# Altium project motordriver-v3.1.PrjPCB
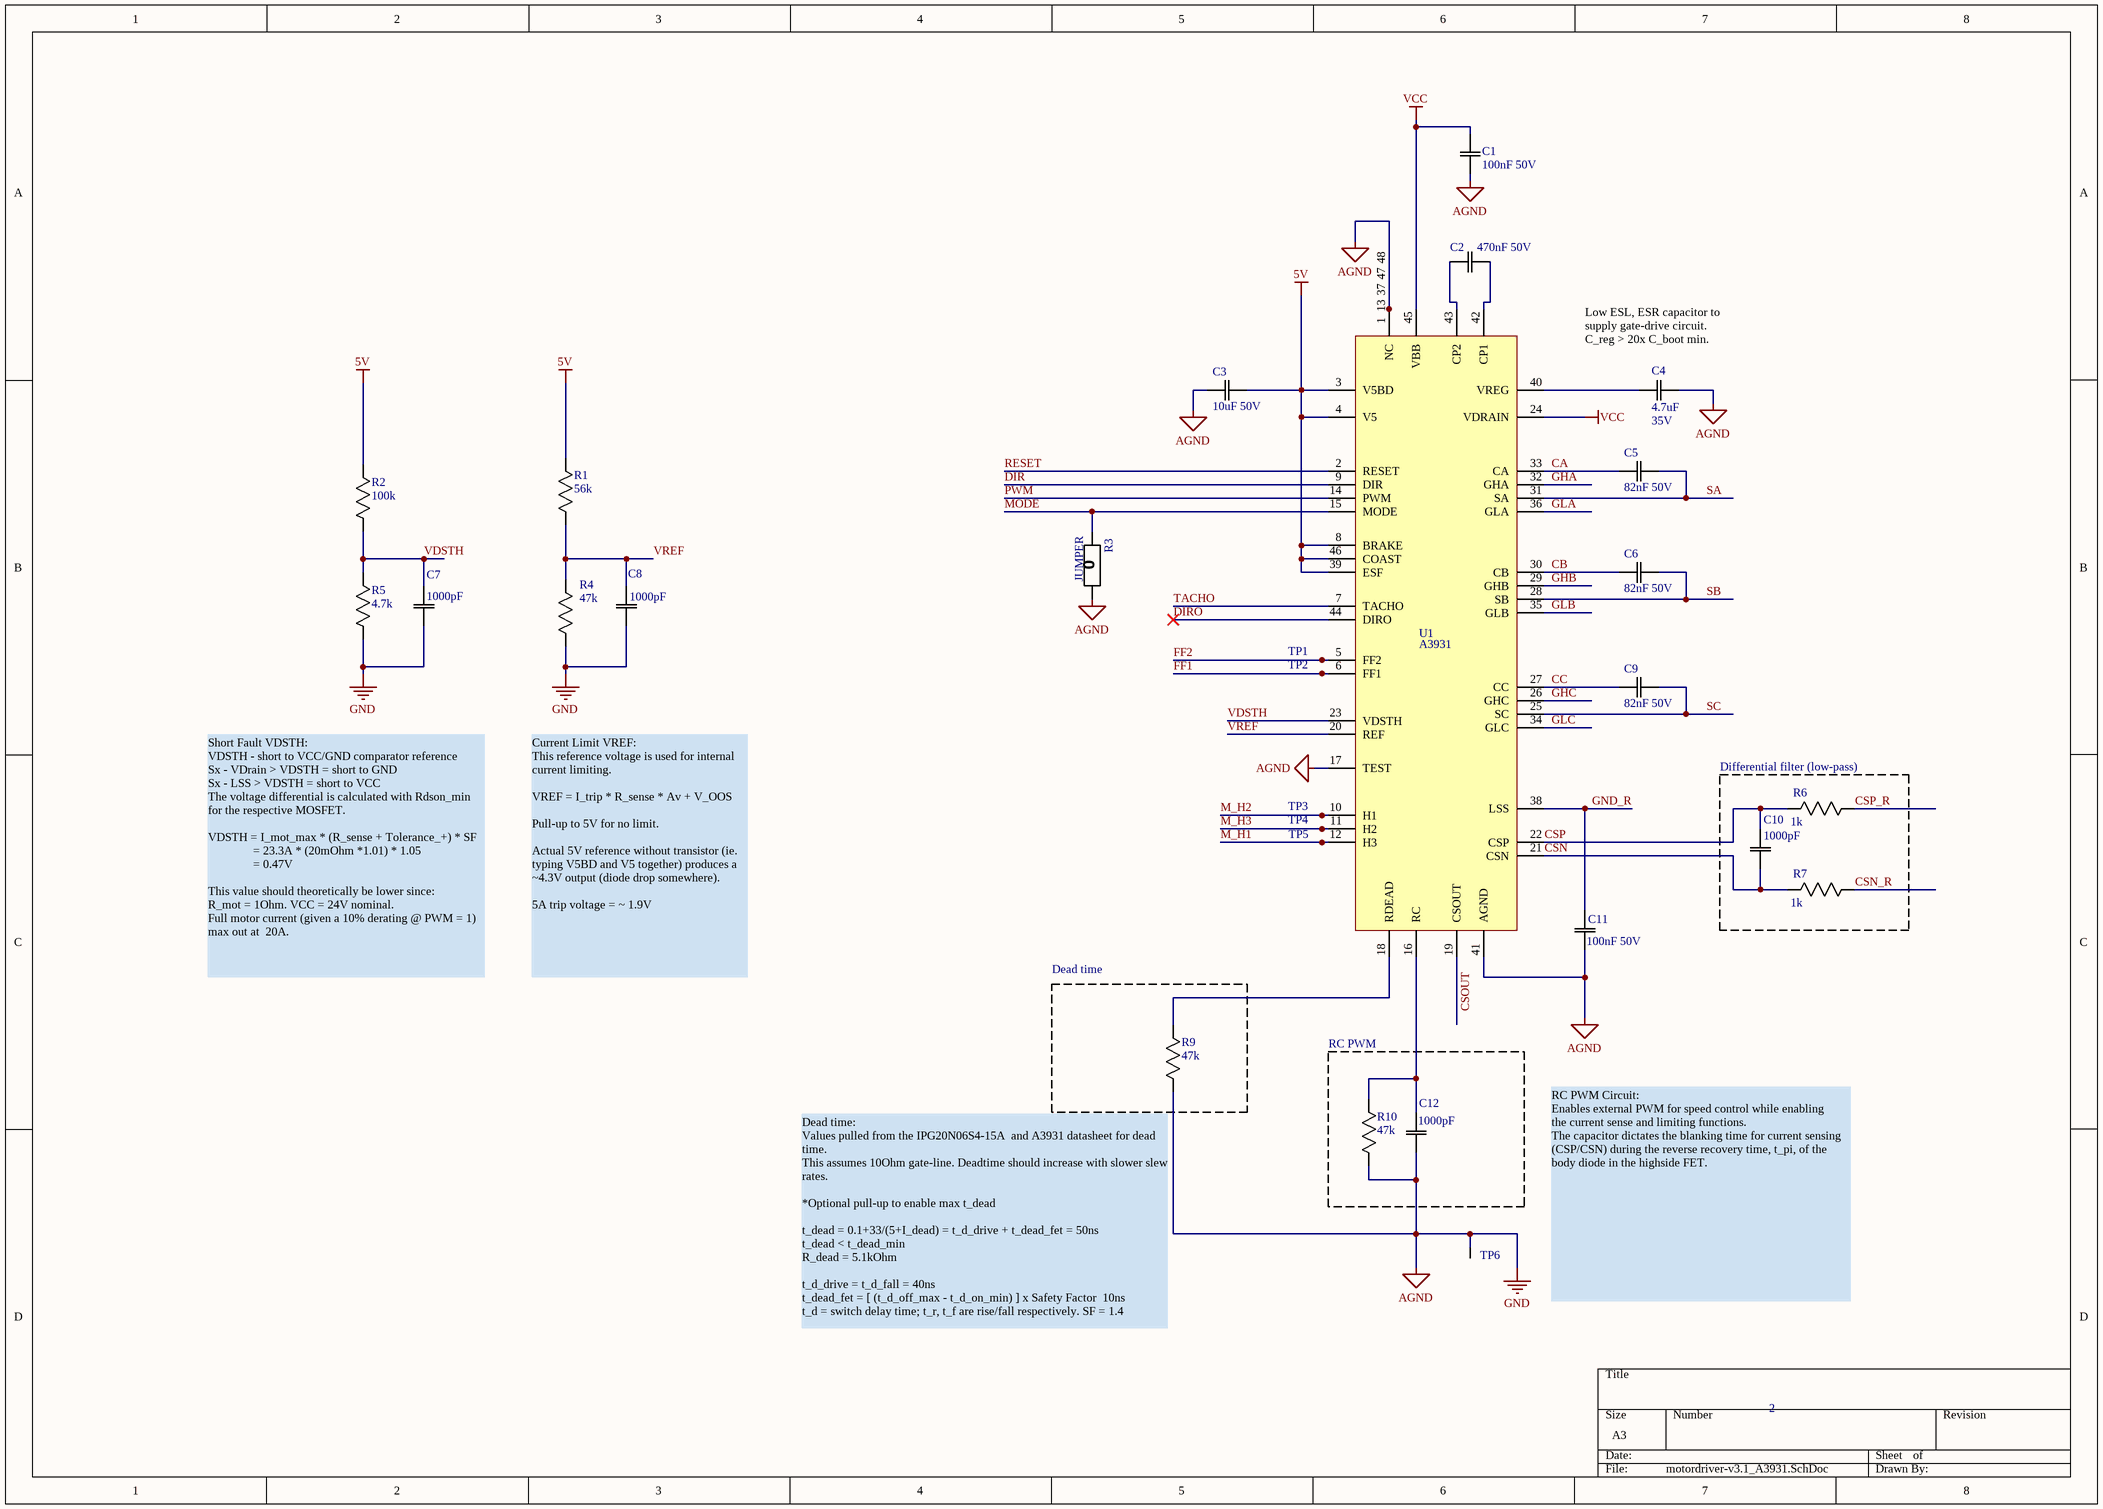
[diagram p0: motordriver-v3.1_A3931.SchDoc]
3 sheets, 53 parts. Net scope: global (net labels, ports and power ports of the same name join across sheets).
Board files: motordriver-v3.1-panelization.PcbDoc, motordriver-v3.1_PCIE.PcbDoc
Sheets:
  motordriver-v3.1_A3931.SchDoc
  motordriver-v3.1_power-stage.SchDoc
  motordriver-v3.1_IO.SchDoc

## Sheet motordriver-v3.1_A3931.SchDoc
size A3

### Parts
C1  100nF 50V  [0603]
C2  470nF 50V  [0603]
C3  10uF 50V  [0805]
C4  Rating: 35V  [0603]  (hidden comment: 4.7uF)
C5  82nF 50V  [0603]
C6  82nF 50V  [0603]
C7  1000pF  [0603]
C8  1000pF  [0603]
C9  82nF 50V  [0603]
C10  1000pF  [0603]
C11  100nF 50V  [0603]
C12  1000pF  [0603]
R1  56k  [0603]
R2  100k  [0603]
R3  JUMPER  [0603]
R4  47k  [0603]
R5  4.7k  [0603]
R6  1k  [0603]
R7  1k  [0603]
R9  47k  [0603]
R10  47k  [0603]
TP1  Test Point (Via)  [TP]  (value not drawn)
TP2  Test Point (Via)  [TP]  (value not drawn)
TP3  Test Point (Via)  [TP]  (value not drawn)
TP4  Test Point (Via)  [TP]  (value not drawn)
TP5  Test Point (Via)  [TP]  (value not drawn)
TP6  Test Point (Via)  [TP]  (value not drawn)
U1  A3931  [48-LQFP-EP (7x7)]

### Blocks framed on the sheet
Differential filter (low-pass): C10 R6 R7
Dead time: R9
RC PWM: C12 R10

### Nets
5V: C3.2(C2) R1.1(R1) R2.1(R1) U1.3(V5BD) U1.4(V5) U1.8(BRAKE) U1.39(ESF) U1.46(COAST)
AGND: C1.1(C1) C3.1(C1) C4.2(C2) C7.1(C1) C8.1(C1) C11.1(C1) C12.1(C1) R3.1(R1) R4.1(R1) R5.2(R2) R9.2(R2) R10.2(R2) TP6.1 U1.1(NC) U1.13 U1.17(TEST) U1.37(NC) U1.41(AGND) U1.47(NC) U1.48(NC)  [also labelled GND]
VCC: C1.2(C2) U1.24(VDRAIN) U1.45(VBB)
CA: C5.1(C1) U1.33(CA)
CB: C6.1(C1) U1.30(CB)
CC: C9.1(C1) U1.27(CC)
CSN: C10.1(C1) R7.2(R2) U1.21(CSN)
CSN_R: R7.1(R1)
CSOUT: U1.19(CSOUT)
CSP: C10.2(C2) R6.2(R2) U1.22(CSP)
CSP_R: R6.1(R1)
DIR: U1.9(DIR)
DIRO: U1.44(DIRO)
FF1: TP2.1 U1.6(FF1)
FF2: TP1.1 U1.5(FF2)
GHA: U1.32(GHA)
GHB: U1.29(GHB)
GHC: U1.26(GHC)
GLA: U1.36(GLA)
GLB: U1.35(GLB)
GLC: U1.34(GLC)
GND_R: C11.2(C2) U1.38(LSS)
M_H1: TP5.1 U1.12(H3)
M_H2: TP3.1 U1.10(H1)
M_H3: TP4.1 U1.11(H2)
MODE: R3.2(R2) U1.15(MODE)
PWM: U1.14(PWM)
RESET: U1.2(RESET)
SA: C5.2(C2) U1.31(SA)
SB: C6.2(C2) U1.28(SB)
SC: C9.2(C2) U1.25(SC)
TACHO: U1.7(TACHO)
VDSTH: C7.2(C2) R2.2(R2) R5.1(R1) U1.23(VDSTH)
VREF: C8.2(C2) R1.2(R2) R4.2(R2) U1.20(REF)
NetC2_1: C2.1(C1) U1.43(CP2)
NetC2_2: C2.2(C2) U1.42(CP1)
NetC4_1: C4.1(C1) U1.40(VREG)
NetC12_2: C12.2(C2) R10.1(R1) U1.16(RC)
NetR9_1: R9.1(R1) U1.18(RDEAD)

### Notes on the sheet
- (near C4) Low ESL, ESR capacitor to supply gate-drive circuit.
  C_reg > 20x C_boot min.
- Short Fault VDSTH:
  VDSTH - short to VCC/GND comparator reference
  Sx - VDrain > VDSTH = short to GND
  Sx - LSS > VDSTH = short to VCC
  The voltage differential is calculated with Rdson_min for the respective MOSFET.
  VDSTH = I_mot_max * (R_sense + Tolerance_+) * SF
  = 23.3A * (20mOhm *1.01) * 1.05
  = 0.47V
  This value should theoretically be lower since:
  R_mot = 1Ohm. VCC = 24V nominal.
  Full motor current (given a 10% derating @ PWM = 1) max out at  20A.
- Current Limit VREF:
  This reference voltage is used for internal current limiting.
  VREF = I_trip * R_sense * Av + V_OOS
  Pull-up to 5V for no limit.
  Actual 5V reference without transistor (ie. typing V5BD and V5 together) produces a ~4.3V output (diode drop somewhere).
  5A trip voltage = ~ 1.9V
- (near R9) Dead time:
  Values pulled from the IPG20N06S4-15A  and A3931 datasheet for dead time.
  This assumes 10Ohm gate-line. Deadtime should increase with slower slew rates.
  *Optional pull-up to enable max t_dead
  t_dead = 0.1+33/(5+I_dead) = t_d_drive + t_dead_fet = 50ns
  t_dead < t_dead_min
  R_dead = 5.1kOhm
  t_d_drive = t_d_fall = 40ns
  t_dead_fet = [ (t_d_off_max - t_d_on_min) ] x Safety Factor  10ns
  t_d = switch delay time; t_r, t_f are rise/fall respectively. SF = 1.4
- RC PWM Circuit:
  Enables external PWM for speed control while enabling
  the current sense and limiting functions.
  The capacitor dictates the blanking time for current sensing
  (CSP/CSN) during the reverse recovery time, t_pi, of the
  body diode in the highside FET.
- 2

### Library data of the parts
C1 C11 = CAP 100nF 50V: CAP CER 0.1UF 50V X7R 0805; Tolerance: 10%; Package: 0805; Value: 100nF; Rating: 50V
C2 = CAP 470nF 50V: CAP CER 0.1UF 50V X7R 0805; Tolerance: 10%; Package: 0805; Value: 470nF; Rating: 50V
C3 = CAP 10uF 50V: CAP CER 10UF 50V X7R; Tolerance: 10%; Package: 1210; Value: 10uF; Rating: 50V; ComponentLink1Description: digikey; ComponentLink1URL: https://www.digikey.ca/en/products/detail/kemet/C1210C106M5RACTU/4918883
C4 = CAP 4.7uF 35V: CAP CER 4.7UF 35V X7R 0603/0805; Tolerance: 10%; Package: 0603/0805; Temperature Coefficient: X7R; Operating Temperature: -55°C ~ 125°C; Value: 4.7uF
C5 C6 C9 = CAP 82nF 50V: CAP CER 0.082UF 50V X7R 0805; Tolerance: 5%; Package: 0805; Value: 82nF; Rating: 50V; Alt. Value: 82nF
C7 C8 C10 C12 = CAP 1000pF 50V: CAP CER 1000PF 50V X7R 0603/0805; Tolerance: 10%; Package: 0603/0805; Value: 1000pF; Rating: 50V; Temperature Coefficient: X7R; Operating Temperature: -55°C ~ 125°C
R1 R2 = RES 100k 1/8W - 1%: RES SMD 100K OHM 1% 1/8W 0805; Power (Watts): 0.125W; Package: 0805; Value: 100k; Tolerance: 1%
R3 = RES 0 JUMPER: RES SMD 0 OHM JUMPER GENERIC 0805; Value: 0; Package: 0805
R4 R10 = RES 47k 1/8W - 1%: RES SMD 47K OHM 1% 1/8W 0805; Power (Watts): 0.125W; Package: 0805; Value: 47k; Tolerance: 1%
R5 = RES 4.7k 1/8W - 1%: RES SMD 4.7k OHM 1% 1/8W 0805; Power (Watts): 0.125W; Package: 0805; Value: 4.7k; Tolerance: 1%
R6 R7 = RES 1k 1/8W: RES SMD 1K OHM 5% 1/8W 0805; Power (Watts): 0.125W; Package: 0805; Value: 1k; Tolerance: 5%
R9 = RES 5.1k 1/8W - 1%: RES SMD 5.1K OHM 1% 1/8W 0805; Power (Watts): 0.125W; Package: 0805; Value: 5.1k; Tolerance: 1%
U1 = A3931_A1: IC MOTOR DRIVER 5.5V-50V 48LQFP - Alternative Symbol; Digikey: 620-1290-1-ND; Digikey Link: https://www.digikey.ca/product-detail/en/allegro-microsystems/A3931KJPTR-T/620-1290-1-ND/2000021; Supplier 1: Digi-Key; Supplier Part Number 1: 620-1290-1-ND

## Sheet motordriver-v3.1_power-stage.SchDoc
size A
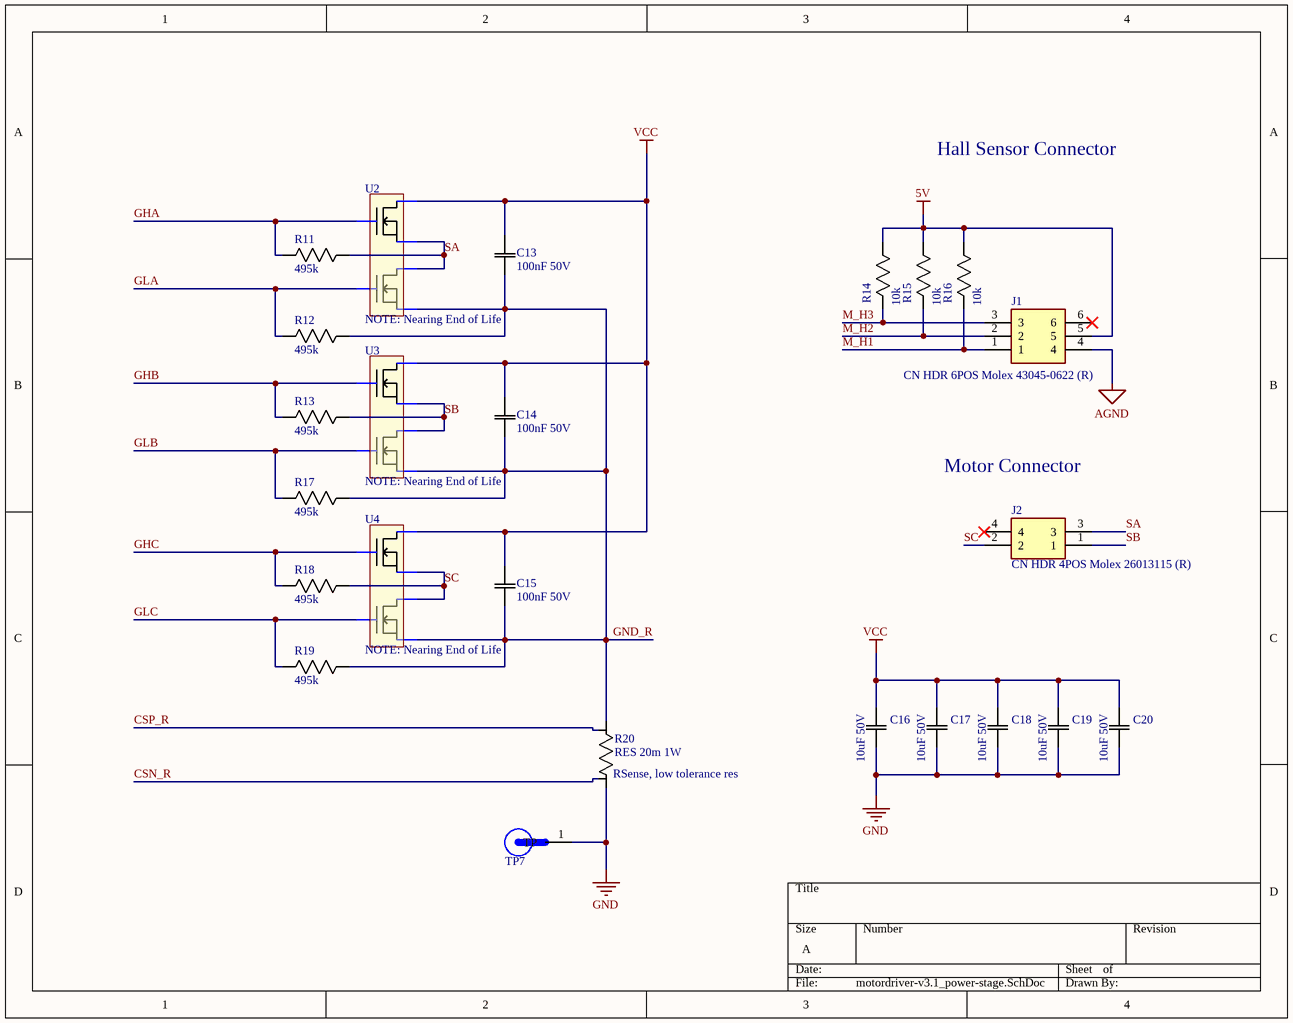
[diagram p1: motordriver-v3.1_power-stage.SchDoc]

### Parts
C13  100nF 50V  [0603]
C14  100nF 50V  [0603]
C15  100nF 50V  [0603]
C16  10uF 50V  [0805]
C17  10uF 50V  [0805]
C18  10uF 50V  [0805]
C19  10uF 50V  [0805]
C20  10uF 50V  [0805]
J1  CN HDR 6POS Molex 43045-0622 (R)  [430450622]
J2  CN HDR 4POS Molex 26013115 (R)  [26013115]
R11  495k  [0603]
R12  495k  [0603]
R13  495k  [0603]
R14  10k  [0603]
R15  10k  [0603]
R16  10k  [0603]
R17  495k  [0603]
R18  495k  [0603]
R19  495k  [0603]
R20  RES 20m 1W  [1206 - Sense]
TP7  Test Point - 5019  [TP380X203]  (value not drawn)
U2  NOTE: Nearing End of Life  [PG-TDSON-8-10]
U3  NOTE: Nearing End of Life  [PG-TDSON-8-10]
U4  NOTE: Nearing End of Life  [PG-TDSON-8-10]

### Nets
5V: J1.5 R14.1(R1) R15.1(R1) R16.1(R1)
AGND: C16.2(C2) C17.2(C2) C18.2(C2) C19.2(C2) C20.2(C2) J1.4 R20.2(R2) TP7.1(TP)  [also labelled GND]
VCC: C13.2(C2) C14.2(C2) C15.2(C2) C16.1(C1) C17.1(C1) C18.1(C1) C19.1(C1) C20.1(C1) U2.8(D1) U3.8(D1) U4.8(D1)
CSN_R: R20.4
CSP_R: R20.3
GHA: R11.2(R2) U2.2(G1)
GHB: R13.2(R2) U3.2(G1)
GHC: R18.2(R2) U4.2(G1)
GLA: R12.2(R2) U2.4(G2)
GLB: R17.2(R2) U3.4(G2)
GLC: R19.2(R2) U4.4(G2)
GND_R: C13.1(C1) C14.1(C1) C15.1(C1) R12.1(R1) R17.1(R1) R19.1(R1) R20.1(R1) U2.3(S2) U3.3(S2) U4.3(S2)
M_H1: J1.1 R16.2(R2)
M_H2: J1.2 R15.2(R2)
M_H3: J1.3 R14.2(R2)
SA: J2.3 R11.1(R1) U2.1(S1) U2.6(D2)
SB: J2.1 R13.1(R1) U3.1(S1) U3.6(D2)
SC: J2.2 R18.1(R1) U4.1(S1) U4.6(D2)

Not connected (* = marked no-connect by the designer): J1 6*; J2 4*

### Notes on the sheet
- Hall Sensor Connector
- Motor Connector
- (near R20) RSense, low tolerance res

### Library data of the parts
C13-C15 = CAP 100nF 50V: as C1 on sheet motordriver-v3.1_A3931; Package: 0805; Value: 100nF; Rating: 50V
C16-C20 = CAP 10uF 50V: CAP CER 10UF 50V X7R; Tolerance: 10%; Package: 1210; Value: 10uF; Rating: 50V; ComponentLink1Description: digikey; ComponentLink1URL: https://www.digikey.ca/en/products/detail/kemet/C1210C106M5RACTU/4918883
J1 = CN HDR 6POS Molex 43045-0622 (R): Molex 43045-0622 6POS Microfit / dual row, right angle
J2 = CN HDR 4POS Molex 26013115 (R): Molex 26013115 4POS Minifit / dual row, right angle
R11-R13 R17-R19 = RES 495k 1/8W: RES SMD 499K OHM 1% 1/8W 0805; Manufacturer: Yageo; Manufacturer Part Number: RC0805FR-07499KL; Temperature Coefficient: 100ppm/°C; Voltage Rating (DC): 150V; Resistance: 499kR; Power Rating: 125mW; Supplier 1: Digi-Key; RoHS: Yes; Category: Chip SMD Resistors; Stock 1: 2275; Pricing 1: 1=0.10000, 10=0.04000, 100=0.01630, 1000=0.00731, 2500=0.00635 (USD); Case/Package: 0805; Case Code (Metric): 2012; Case Code (Imperial): 0805; Contact Plating: Tin,Lead,Matte; Min Operating Temperature: -55°C; Max Operating Temperature: 155°C; Termination: SMD/SMT; Composition: Thick Film; Military Standard: Not; Tolerance: 1%; Voltage Rating: 150V; Packaging: Tape and Reel; Length: 2mm; Depth: 1.25mm; Radiation Hardening: No; Lead Free: Lead Free; ComponentLink1URL: https://datasheet.ciiva.com/15189/getdatasheetpartid-326570-15189975.pdf?src-supplier=Verical; ComponentLink1Description: https://datasheet.ciiva.com/15189/getdatasheetpartid-326570-15189975.pdf?src-supplier=Verical; Supplier Part Number 1: 311-499KCRCT-ND
R14-R16 = RES 10k 1/8W - 1%: RES SMD 10K OHM 1% 1/8W 0805; Power (Watts): 0.125W; Package: 0805; Value: 10k; Tolerance: 1%
R20 = RES 20m 1W: RES SMD 0.02 OHM 1% 1W 1206
TP7 = Test Point - 5019: PC Test Point, Miniature Phosphor Bronze, Silver Plating Surface Mount Mounting Type; MP: 5019; MF: Keystone Electronics; Value: *; Package: 2010 Keystone; Digi-Key_Part_Number: 36-5019CT-ND; Digi-Key_Purchase_URL: https://www.digikey.com/product-detail/en/keystone-electronics/5019/36-5019CT-ND/3907344?utm_source=snapeda&utm_medium=aggregator&utm_campaign=symbol
U2-U4 = MOSFET IPG20N06S4-15A: MOSFET N+N 60V 20A; MF: Infineon Technologies; MF P/N: IPG20N06S4-15A; Supplier 1: Mouser; Supplier Part Number 1: 726-IPG20N06S415ATMA

## Sheet motordriver-v3.1_IO.SchDoc
size A
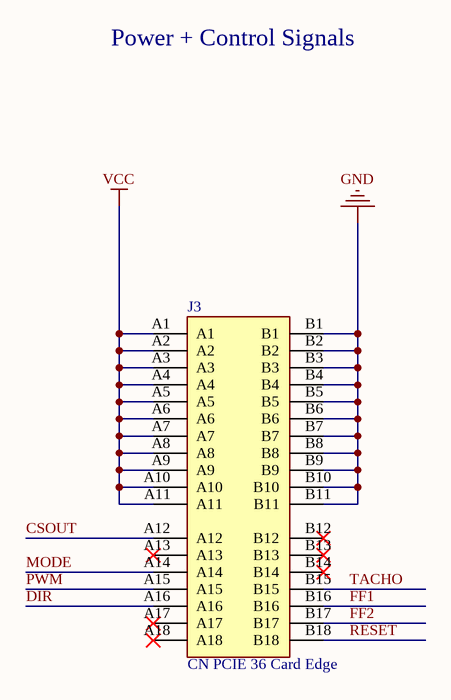
[diagram p2: motordriver-v3.1_IO.SchDoc]

### Parts
J3  CN PCIE 36 Card Edge  [CN PCIE EDGE 36CKT]

### Nets
GND: J3.B1 J3.B2 J3.B3 J3.B4 J3.B5 J3.B6 J3.B7 J3.B8 J3.B9 J3.B10 J3.B11  [project net AGND]
VCC: J3.A1 J3.A2 J3.A3 J3.A4 J3.A5 J3.A6 J3.A7 J3.A8 J3.A9 J3.A10 J3.A11
CSOUT: J3.A12
DIR: J3.A16
FF1: J3.B16
FF2: J3.B17
MODE: J3.A14
PWM: J3.A15
RESET: J3.B18
TACHO: J3.B15

Not connected (* = marked no-connect by the designer): J3 A13* A17* A18* B12* B13* B14*

### Notes on the sheet
- Power + Control Signals

### Library data of the parts
J3 = CN PCIE 36 Card Edge: 36 Position Male PCIE Connector

## Nets that join several sheets
5V: motordriver-v3.1_A3931 (8 pins), motordriver-v3.1_power-stage (J1.5 R14.1 R15.1 R16.1)
AGND: motordriver-v3.1_A3931 (20 pins), motordriver-v3.1_power-stage (8 pins), motordriver-v3.1_IO (11 pins)
VCC: motordriver-v3.1_A3931 (C1.2 U1.24 U1.45), motordriver-v3.1_power-stage (11 pins), motordriver-v3.1_IO (11 pins)
CSN_R: motordriver-v3.1_A3931 (R7.1), motordriver-v3.1_power-stage (R20.4)
CSOUT: motordriver-v3.1_A3931 (U1.19), motordriver-v3.1_IO (J3.A12)
CSP_R: motordriver-v3.1_A3931 (R6.1), motordriver-v3.1_power-stage (R20.3)
DIR: motordriver-v3.1_A3931 (U1.9), motordriver-v3.1_IO (J3.A16)
FF1: motordriver-v3.1_A3931 (TP2.1 U1.6), motordriver-v3.1_IO (J3.B16)
FF2: motordriver-v3.1_A3931 (TP1.1 U1.5), motordriver-v3.1_IO (J3.B17)
GHA: motordriver-v3.1_A3931 (U1.32), motordriver-v3.1_power-stage (R11.2 U2.2)
GHB: motordriver-v3.1_A3931 (U1.29), motordriver-v3.1_power-stage (R13.2 U3.2)
GHC: motordriver-v3.1_A3931 (U1.26), motordriver-v3.1_power-stage (R18.2 U4.2)
GLA: motordriver-v3.1_A3931 (U1.36), motordriver-v3.1_power-stage (R12.2 U2.4)
GLB: motordriver-v3.1_A3931 (U1.35), motordriver-v3.1_power-stage (R17.2 U3.4)
GLC: motordriver-v3.1_A3931 (U1.34), motordriver-v3.1_power-stage (R19.2 U4.4)
GND_R: motordriver-v3.1_A3931 (C11.2 U1.38), motordriver-v3.1_power-stage (10 pins)
M_H1: motordriver-v3.1_A3931 (TP5.1 U1.12), motordriver-v3.1_power-stage (J1.1 R16.2)
M_H2: motordriver-v3.1_A3931 (TP3.1 U1.10), motordriver-v3.1_power-stage (J1.2 R15.2)
M_H3: motordriver-v3.1_A3931 (TP4.1 U1.11), motordriver-v3.1_power-stage (J1.3 R14.2)
MODE: motordriver-v3.1_A3931 (R3.2 U1.15), motordriver-v3.1_IO (J3.A14)
PWM: motordriver-v3.1_A3931 (U1.14), motordriver-v3.1_IO (J3.A15)
RESET: motordriver-v3.1_A3931 (U1.2), motordriver-v3.1_IO (J3.B18)
SA: motordriver-v3.1_A3931 (C5.2 U1.31), motordriver-v3.1_power-stage (J2.3 R11.1 U2.1 U2.6)
SB: motordriver-v3.1_A3931 (C6.2 U1.28), motordriver-v3.1_power-stage (J2.1 R13.1 U3.1 U3.6)
SC: motordriver-v3.1_A3931 (C9.2 U1.25), motordriver-v3.1_power-stage (J2.2 R18.1 U4.1 U4.6)
TACHO: motordriver-v3.1_A3931 (U1.7), motordriver-v3.1_IO (J3.B15)

## Assembly variants
Default motordriver-v3.0: not fitted C4 C12 C15 P1 Q1 Q1 R18 R?